# EAGLE design FSG_2019_BSPD_0.2_SMD (EAGLE 9.2.1)
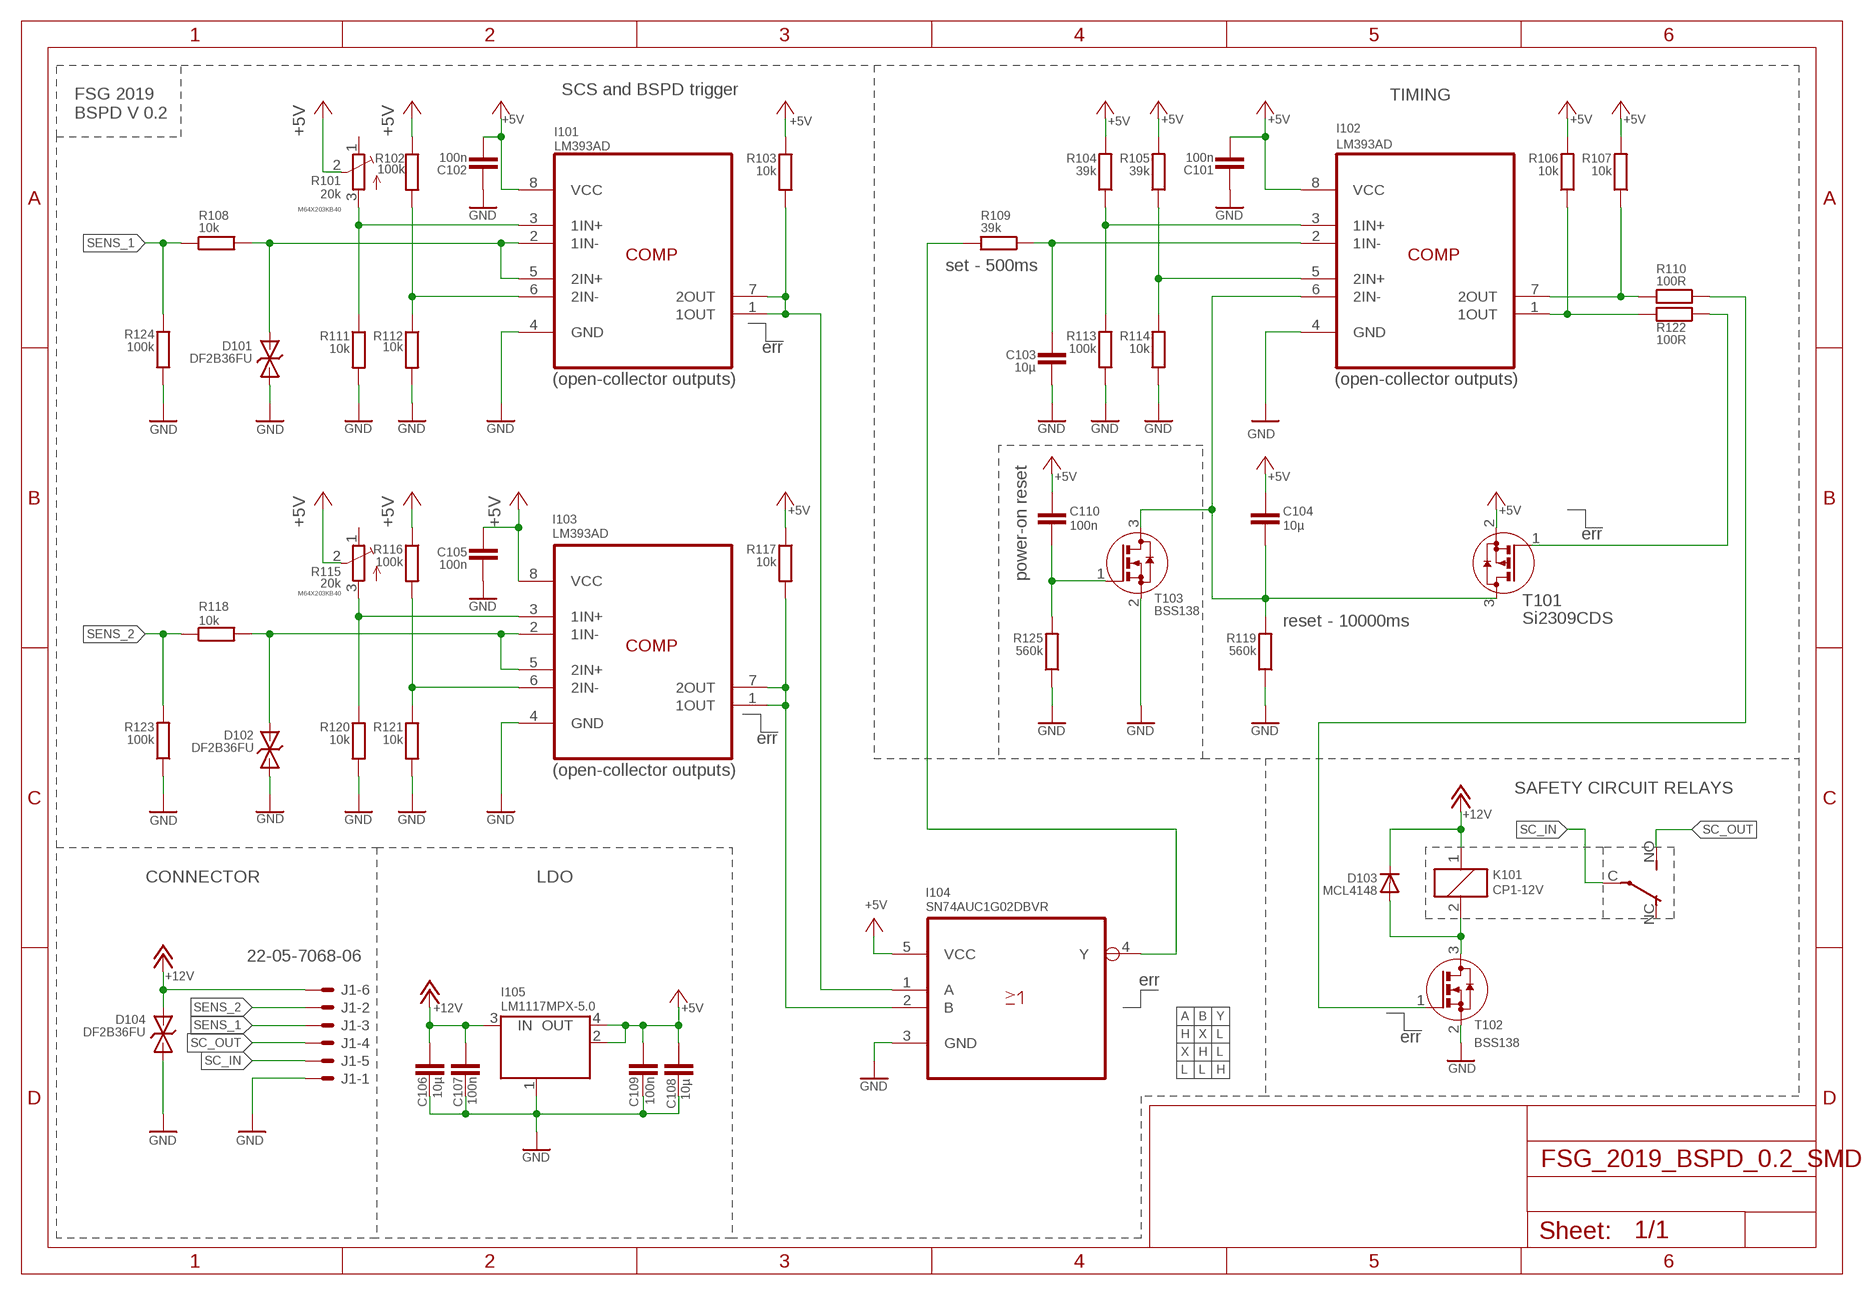
[diagram p0: schematic, sheet 1]

## Parts
C101  100n  C-EUC0603  [C0603]
C102  100n  C-EUC0603  [C0603]
C103  10µ  C-EUC1206  [C1206]
C104  10µ  C-EUC1206K  [C1206K]
C105  100n  C-EUC0603  [C0603]
C106  10µ  C-EUC1206  [C1206]
C107  100n  C-EUC0603  [C0603]
C108  10µ  C-EUC1206  [C1206]
C109  100n  C-EUC0603  [C0603]
C110  100n  C-EUC0603  [C0603]
D101  DF2B36FU  [SOD323]
D102  DF2B36FU  [SOD323]
D103  MCL4148  D.MCL4148  [MICROMELF]
D104  DF2B36FU  [SOD323]
I101  LM393AD  [SOIC127P600X175-8N]
I102  LM393AD  [SOIC127P600X175-8N]
I103  LM393AD  [SOIC127P600X175-8N]
I104  SN74AUC1G02DBVR  NC7SZ08M5X  [SOT95P280X145-5N]
I105  LM1117MPX-5.0  0022_LM1117IMPX-5.0  [LINEAR_SOT223]
J1  22-05-7068-06  [7395-06]
K101  CP1-12V  [CP1]
R101  20k  POTI.M64X201KB40  [M64X201KB40]
R102  100k  R-EU_R0603  [R0603]
R103  10k  R-EU_R0603  [R0603]
R104  39k  R-EU_R0603  [R0603]
R105  39k  R-EU_R0603  [R0603]
R106  10k  R-EU_R0603  [R0603]
R107  10k  R-EU_R0603  [R0603]
R108  10k  R-EU_R0603  [R0603]
R109  39k  R-EU_R0603  [R0603]
R110  100R  R-EU_R0603  [R0603]
R111  10k  R-EU_R0603  [R0603]
R112  10k  R-EU_R0603  [R0603]
R113  100k  R-EU_R0603  [R0603]
R114  10k  R-EU_R0603  [R0603]
R115  20k  POTI.M64X201KB40  [M64X201KB40]
R116  100k  R-EU_R0603  [R0603]
R117  10k  R-EU_R0603  [R0603]
R118  10k  R-EU_R0603  [R0603]
R119  560k  R-EU_R0603  [R0603]
R120  10k  R-EU_R0603  [R0603]
R121  10k  R-EU_R0603  [R0603]
R122  100R  R-EU_R0603  [R0603]
R123  100k  R-EU_R0603  [R0603]
R124  100k  R-EU_R0603  [R0603]
R125  560k  R-EU_R0603  [R0603]
T101  Si2309CDS  P-MOSFET.SOT23  [SOT-23]
T102  BSS138  N-MOSFET.SOT23  [SOT-23]
T103  BSS138  N-MOSFET.SOT23  [SOT-23]

## Nets
+5V: C101.2 C102.2 C104.1 C105.2 C108.1 C109.2 C110.1 I101.8(VCC) I102.8(VCC) I103.8(VCC) I104.5(VCC) I105.2(OUT) I105.4(OUT) R101.2(M) R102.1 R103.1 R104.2 R105.2 R106.2 R107.2 R115.2(M) R116.1 R117.1 T101.2(S)
+12V: C106.1 C107.1 D103.C D104.2(C) I105.3(IN) J1.6 K101.1
BRAKE_F: D101.2(C) I101.2(1IN-) I101.5(2IN+) R108.2
DF: D102.2(C) I103.2(1IN-) I103.5(2IN+) R118.2
GND: C101.1 C102.1 C103.2 C105.1 C106.2 C107.2 C108.2 C109.1 D101.1(A) D102.1(A) D104.1(A) I101.4(GND) I102.4(GND) I103.4(GND) I104.3(GND) I105.1(GND/ADJ) J1.1 R111.2 R112.2 R113.1 R114.1 R119.1 R120.2 R121.2 R123.1 R124.1 R125.1 T102.2(S) T103.2(S)
N$1: I102.5(2IN+) R105.1 R114.2
N$2: I103.1(1OUT) I103.7(2OUT) I104.2(B) R117.2
N$3: I101.1(1OUT) I101.7(2OUT) I104.1(A) R103.2
N$4: I102.1(1OUT) R106.1 R122.2
N$5: C110.2 R125.2 T103.1(G)
N$6: I101.3(1IN+) R101.3(A) R111.1
N$7: C104.2 I102.6(2IN-) R119.2 T101.3(D) T103.3(D)
N$8: I103.3(1IN+) R115.3(A) R120.1
N$10: R110.1 T102.1(G)
N$11: D103.A K101.2 T102.3(D)
N$12: C103.1 I102.2(1IN-) R109.1
N$13: I102.3(1IN+) R104.1 R113.2
N$14: I101.6(2IN-) R102.2 R112.1
N$15: I102.7(2OUT) R107.1 R110.2
N$16: I103.6(2IN-) R116.2 R121.1
N$20: R122.1 T101.1(G)
N$66: I104.4(Y) R109.2
SC_IN: J1.5 K101.C(2:P)
SC_OUT: J1.4 K101.NO(2:S)
SENS_1: J1.3 R108.1 R124.2
SENS_2: J1.2 R118.1 R123.2
Unconnected: K101.NC(2:O) R101.1(E) R115.1(E)

## Notes on the sheet
- SCS and BSPD trigger
- TIMING
- FSG 2019
  BSPD V 0.2
- M64X203KB40
- COMP | COMP
- set - 500ms
- err
- (open-collector outputs) | (open-collector outputs)
- err
- power-on reset
- M64X203KB40
- reset - 10000ms
- COMP
- err
- (open-collector outputs)
- SAFETY CIRCUIT RELAYS
- CONNECTOR | LDO
- err
- A | B | Y
- H | X | L
- err
- X | H | L
- L | L | H

## Library data of the parts
C101 C102 C105 = resistor:C-EU: CAPACITOR, European symbol
C103 C104 C106-C110 = rcl:C-EU: CAPACITOR, European symbol
D101 D102 D104 = diode:DF2B36FU
D103 = MCS-Dioden:D; HEIGHT: 1.2
I101-I103 = TI-LM393AD:LM393AD: DUAL DIFFERENTIAL COMPARATORS,SOIC-8; MPN: LM393AD; OC_FARNELL: 4586128; OC_NEWARK: 91F3640; PACKAGE: SOIC- 8; SUPPLIER: TEXAS INSTRUMENTS
I104 = Arduino:NC7SZ08M5X: Tiny logic UHS Two Input AND Gate; MPN: NC7SZ08M5X; OC_FARNELL: 1613980; OC_NEWARK: 58K1975; PACKAGE: SOT-23-5; SUPPLIER: Fairchild
I105 = IntegratedCircuits:0022_LM1117IMPX-5.0: Low-dropout linear regulator 5V -LM1117IMPX-5.0; CASE: SOT223; MONTHLY_USAGE: _____; PART_NUMBER: LM1117IMPX-5.0; PRICE: _____; SUPPLIER: _____; TYPE: Circuito_Integrato; VALUE: LM1117IMPX-5.0
J1 = con-molex:22-?-06: CONNECTOR wire to board 2.54 mm (.1 inch) pitch header; MF: MOLEX; OC_FARNELL: unknown; OC_NEWARK: unknown
K101 = relay:CP1?-*: ULTRA-MINIATURE LOW PROFILE AUTOMOTIVE RELAY NAiS Source: http://www.mew-europe.com/.. en_ds_61207_0000.pdf; MF: AROMAT/ MATSUSHITA; MPN: CP1-12V; OC_FARNELL: unknown; OC_NEWARK: 10C5508
R101 R115 = MCS-rcl:POTI
R102-R114 R116-R125 = resistor:R-EU_: RESISTOR, European symbol
T101 = MCS-Transistoren:P-MOSFET; HEIGHT: 1.2
T102 T103 = MCS-Transistoren:N-MOSFET; HEIGHT: 1.2

## Board
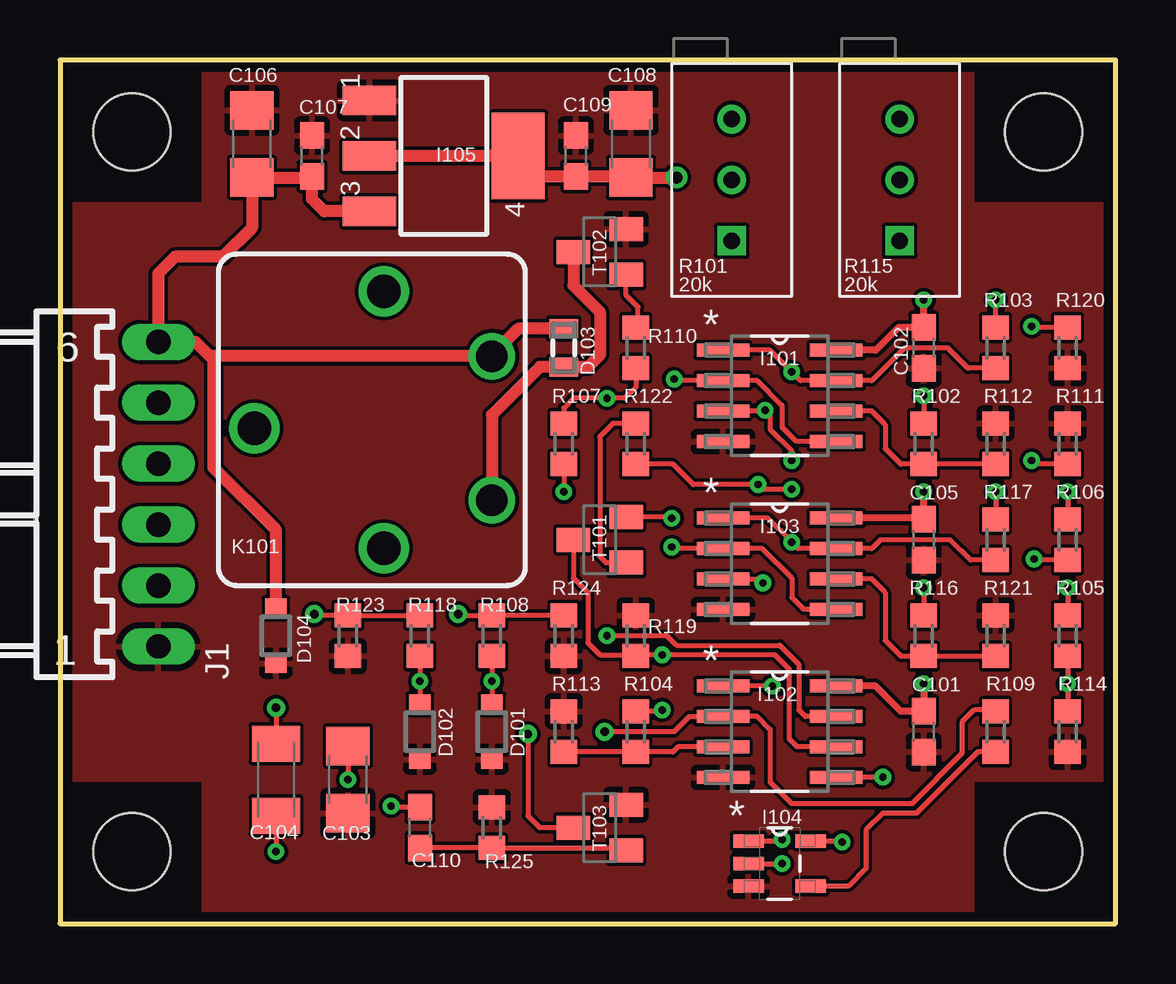
[diagram p1: board, top side]
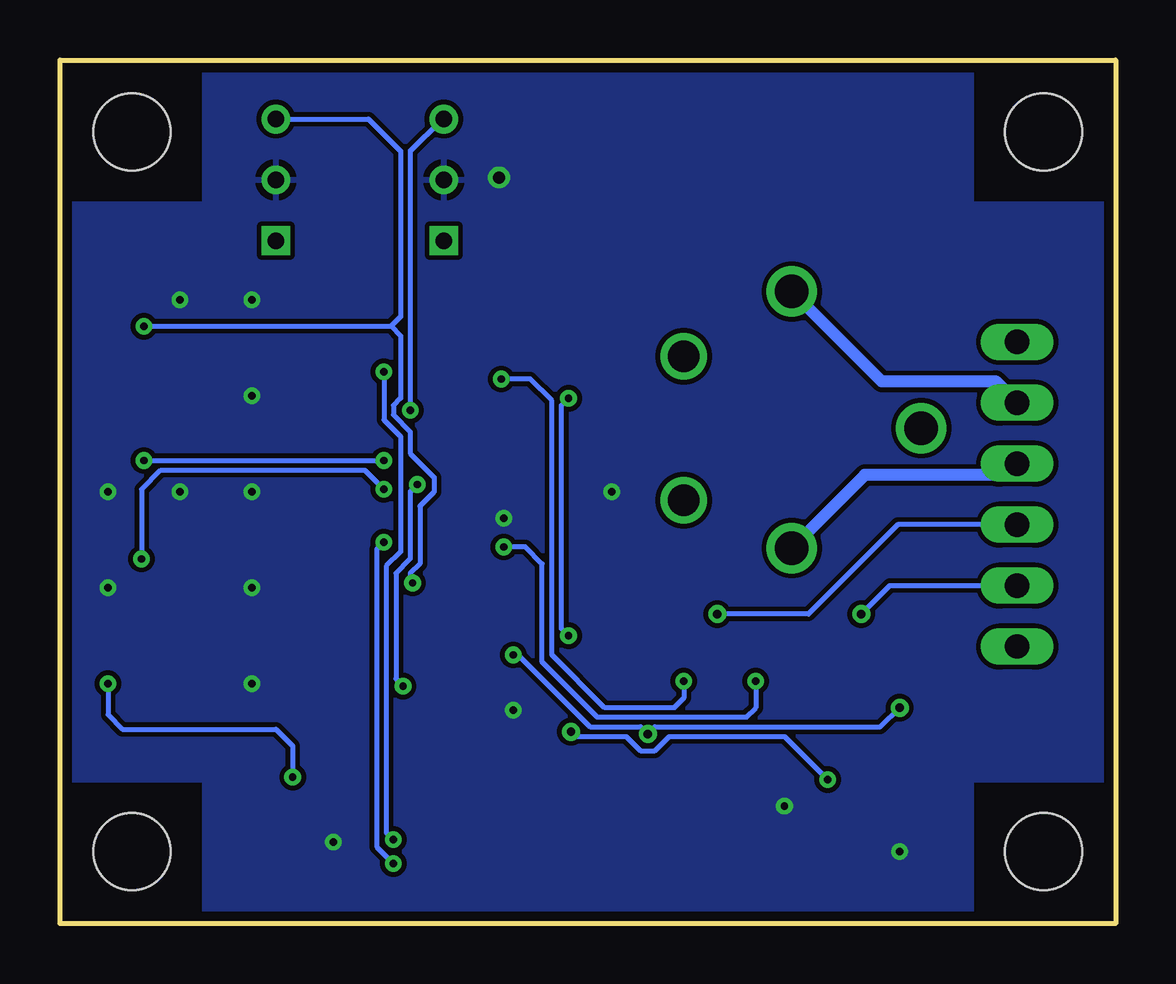
[diagram p2: board, bottom side, seen from below]

Size 44 x 36 mm. Coordinates in mm from the lower left corner, seen from the top.
Outline: 0,0 44,0 44,36 0,36 0,0
Copper layers (1*16): Top 0.035mm / dielectric 0.11mm / Bottom 0.035mm
Design rules "MCS-standard *": minimum track width 0.15mm, minimum drill 0.3mm, track to track 0.15mm, track to pad 0.15mm, pad to pad 0.15mm, via to via 0.15mm, smd to smd 0.15mm, copper to edge 0.4mm, drill to drill 0.3mm, minimum pad ring 10mil, minimum via ring 0.2mm, stop-mask expansion 0.05mm, vias tented up to drill 0.4mm, thermal gap 10mil
Holes 3.2 mm at 3,33 3,3 41,3 41,33
tKeepout: area 38.2,30.2 to 43.8,35.8; area 0.2,30.2 to 5.8,35.8; area 0.2,0.2 to 5.8,5.8; area 38.2,0.2 to 43.8,5.8

### Footprints (pad centres in the part's own frame; a part is rotated, then mirrored left to right if it is on the bottom)
C0603 = smd 1.1 x 1: 1 -0.85,0; 2 0.85,0
C1206 = smd 1.6 x 1.8: 1 -1.4,0; 2 1.4,0
C1206K = smd 1.5 x 2: 1 -1.5,0; 2 1.5,0
SOD323 = smd 0.8 x 0.9: 1 -1.15,0; 2 1.15,0
MICROMELF = smd 0.8 x 1.2: A -0.8,0; C 0.8,0
SOIC127P600X175-8N = smd 2.184 x 0.559: 1 -2.362,1.905; 2 -2.362,0.635; 3 -2.362,-0.635; 4 -2.362,-1.905; 5 2.362,-1.905; 6 2.362,-0.635; 7 2.362,0.635; 8 2.362,1.905
SOT95P280X145-5N = smd 1.27 x 0.559: 1 -1.295,0.94; 2 -1.295,0; 3 -1.295,-0.94; 4 1.295,-0.94; 5 1.295,0.94
LINEAR_SOT223 = smd 1.219 x 2.235: 1 -2.311,-3.099; 2 0,-3.099; 3 2.311,-3.099 | smd 3.6 x 2.2: 4 0,3.099
7395-06 = drill 1.016 long: 1 6.35,0; 2 3.81,0; 3 1.27,0; 4 -1.27,0; 5 -3.81,0; 6 -6.35,0
CP1 = drill 1.3: 1 2.65,-4.5; 2 -3.35,-4.5 | drill 1.4: C 5.35,0; NC -0.35,5.4; NO -5.35,0
M64X201KB40 = drill 0.7 square: 1 -2.54,0 | drill 0.7: 2 0,0; 3 2.54,0
R0603 = smd 1 x 1.1: 1 -0.85,0; 2 0.85,0
SOT-23 = smd 1 x 1.4: 1 -0.95,-1.1; 2 0.95,-1.1; 3 0,1.1

### Placement (x,y rotation side)
C101  36,8 90 top
C102  36,24 90 top
C103  12,6 270 top
C104  9,6 90 top
C105  36,16 90 top
C106  8,32.5 90 top
C107  10.5,32 90 top
C108  23.8,32.5 90 top
C109  21.5,32 270 top
C110  15,4 270 top
D101  18,8 90 top
D102  15,8 90 top
D103  21,24 90 top
D104  9,12 90 top
I101  30,22 0 top
I102  30,8 0 top
I103  30,15 0 top
I104  30,2.5 0 top
I105  16,32 270 top
J1  4.1,17.9 270 top
K101  13.5,21 90 top
R101  28,31 90 top
R102  36,20 270 top
R103  39,24 270 top
R104  24,8 90 top
R105  42,12 90 top
R106  42,16 90 top
R107  21,20 270 top
R108  18,12 270 top
R109  39,8 270 top
R110  24,24 270 top
R111  42,20 90 top
R112  39,20 90 top
R113  21,8 270 top
R114  42,8 90 top
R115  35,31 90 top
R116  36,12 270 top
R117  39,16 270 top
R118  15,12 270 top
R119  24,12 270 top
R120  42,24 270 top
R121  39,12 90 top
R122  24,20 270 top
R123  12,12 90 top
R124  21,12 90 top
R125  18,4 270 top
T101  22.5,16 90 top
T102  22.5,28 90 top
T103  22.5,4 90 top

### Tracks (layer width: path | path; a pad name or v marks a point on that pad's centre or on a via)
+5V  (via drill 0.3, 0.5)
  Top 0.2: v36,14 R116.1 | v36,22 R102.1 | R107.2 v21,18 | T101.2 25.45,16.95 v25.5,16.9 | R104.2 25.05,8.85 v25.1,8.9 | v42,14 R105.2 | v42,18 R106.2 | C110.1 13.85,4.85 v13.8,4.9 | C104.1 v9,3 | I104.5 32.56,3.44 v32.6,3.4 | v39,18 R117.1 | R103.1 v39,26
  Top 0.3: I101.8 34.01,23.91 34.95,24.85 C102.2 v36,26 | I103.8 35.95,16.91 C105.2 v36,18 | I102.8 33.99,9.9 35.05,8.85 C101.2 v36,10
  Top 0.5: I105.2 I105.4 19.95,31.15 C109.2 23.75,31.15 C108.1 v25.7,31.1
  pour Bottom (isolate 0.2): 6,36 38,36 38,30 44,30 44,6 38,6 38,0 6,0 6,6 0,6 0,30 6,30
+12V
  Top 0.5: K101.1 18,23.7 19.1,24.8 D103.C | I105.3 11.01,29.69 10.5,30.2 C107.1 10.45,31.1 C106.1 8,29 6.8,27.8 4.8,27.8 4.1,27.1 | D104.2 9,16.4 6.4,19
  Top 0.508: 4.1,27.1 J1.6 5.65,24.25 6.15,23.75 6.25,23.65 | 6.4,19 6.4,23.5 6.25,23.65 | K101.1 6.25,23.65
BRAKE_F  (via drill 0.3)
  Top 0.2: v25.6,22.7 25.66,22.64 I101.2 29.07,22.64 30.1,21.6 30.1,20.7 30.7,20.1 I101.5 | D101.2 v18,10.1 R108.2
  Bottom 0.2: v25.6,22.7 24.4,22.7 23.5,21.8 23.5,11.2 21.3,9 18.4,9 18,9.4 v18,10.1
DF  (via drill 0.3)
  Top 0.2: v25.5,15.7 25.57,15.63 I103.2 29.27,15.63 30.5,14.4 30.5,13.6 31,13.1 I103.5 | R118.2 v15,10.1 D102.2
  Bottom 0.2: v15,10.1 15,9 15.4,8.6 21.6,8.6 23.9,10.9 23.9,15 24.6,15.7 v25.5,15.7
GND
  pour Top: 0,30 6,30 6,36 38,36 38,30 44,30 44,6 38,6 38,0 6,0 6,6 0,6
N$1  (via drill 0.3)
  Top 0.2: R114.2 v42,10 R105.1 | I102.5 v34.3,6.09 v34.3,6.1
  Bottom 0.2: v42,10 42,8.7 41.4,8.1 35,8.1 34.3,7.4 v34.3,6.1
N$2  (via drill 0.3)
  Top 0.2: I103.1 29.5,16.91 v30.5,15.9 30.77,15.63 I103.7 33.84,15.63 34.2,16 37.1,16 37.95,15.15 R117.2 | I104.2 v30.1,2.5
  Bottom 0.2: v30.5,15.9 30.8,15.6 30.8,3.2 v30.1,2.5
N$3  (via drill 0.3)
  Top 0.2: I101.1 29.59,23.91 v30.5,23 30.86,22.64 I101.7 33.84,22.64 35.2,24 37,24 37.85,23.15 R103.2 | I104.1 30.04,3.44 v30.1,3.5
  Bottom 0.2: v30.5,23 30.5,21 29.8,20.3 29.8,15.5 30.4,14.9 30.4,3.8 v30.1,3.5
N$4  (via drill 0.3)
  Top 0.2: R122.2 25.55,19.15 26.4,18.3 v29.1,18.3 29.3,18.1 v30.5,18.1 | v29.7,9.9 I102.1 | R106.1 40.65,15.15 v40.6,15.2
  Bottom 0.2: v29.1,18.3 29.4,18 29.4,15.2 30,14.6 30,10.2 v29.7,9.9 | v40.6,15.2 40.6,18.1 39.8,18.9 31.3,18.9 v30.5,18.1
N$5
  Top 0.2: C110.2 R125.2 23.5,3.15 T103.1
N$6  (via drill 0.3)
  Top 0.2: I101.3 29.36,21.36 v29.4,21.4 29.6,21.2 29.6,20.6 30.5,19.7 v30.5,19.3 | R111.1 40.65,19.15 v40.5,19.3
  Bottom 0.2: v29.4,21.4 29.4,32.2 28.06,33.54 R101.3 | v40.5,19.3 v30.5,19.3
N$7  (via drill 0.3, 0.35)
  Top 0.2: v9,9 C104.2 | T101.3 21.4,14.4 22,13.8 22,11.7 22.5,11.2 24.05,11.2 | T103.3 20,4 19.5,4.5 v19.5,7.9 | I102.6 30.73,7.37 30.4,7.7 30.4,10.6 29.8,11.2 v25.1,11.2 24.05,11.2 | 24.05,11.2 R119.2
  Bottom 0.2: v9,9 9.8,8.2 19.2,8.2 v19.5,7.9 19.8,8.2 21.9,8.2 24.9,11.2 v25.1,11.2
N$8  (via drill 0.3)
  Top 0.2: v29.3,14.2 29.14,14.37 I103.3 | R120.1 40.55,24.85 v40.5,24.9
  Bottom 0.2: R115.3 31.14,33.54 29.8,32.2 29.8,25.3 30.2,24.9 | 30.2,24.9 29.8,24.5 29.8,21.9 30.1,21.6 30.1,21.2 29.4,20.5 29.4,19.6 28.4,18.6 28.4,18 29,17.4 29,15 29.4,14.6 29.4,14.3 v29.3,14.2 | v40.5,24.9 30.2,24.9
N$10
  Top 0.2: R110.1 24.1,24.95 24.1,25.7 23.6,26.2 T102.1
N$11
  Top 0.5: T102.3 21.4,26.6 22.5,25.5 22.5,23.7 22,23.2 D103.A 20,23.2 18,21.2 K101.2
N$12  (via drill 0.3, 0.35)
  Top 0.2: R109.1 38.95,8.9 38.1,8.9 37.6,8.4 37.6,7.1 35.5,5 30.5,5 29.6,5.9 29.6,8.1 29.07,8.63 I102.2 26.23,8.63 25.6,8 v22.7,8 | C103.1 v12,6
  Bottom 0.2: v12,6 13.8,7.8 18.6,7.8 19.2,7.2 19.8,7.2 20.4,7.8 22.5,7.8 v22.7,8
N$13
  Top 0.2: I102.3 25.77,7.37 25.55,7.15 R104.1 R113.2
N$14
  Top 0.2: R112.1 R102.2 35.05,19.15 34.4,19.8 34.4,20.8 33.84,21.36 I101.6
N$15  (via drill 0.3)
  Top 0.2: R107.1 21,21.5 21.4,21.9 v22.8,21.9 23.55,21.9 24,22.35 R110.2 | I102.7 31.07,8.63 30.8,8.9 30.8,10.8 30,11.6 25.7,11.6 25.3,12 v22.8,12
  Bottom 0.2: v22.8,12 23.1,12.3 23.1,21.6 v22.8,21.9
N$16
  Top 0.2: I103.6 33.84,14.37 34.4,13.8 34.4,11.8 35.05,11.15 R116.2 R121.1
N$20
  Top 0.2: R122.1 23.05,20.85 22.5,20.3 22.5,15.3 22.75,15.05 T101.1
N$66
  Top 0.2: R109.2 38.25,7.15 35.7,4.6 34.3,4.6 33.6,3.9 33.6,2.3 32.86,1.56 I104.4
SC_IN
  Bottom 0.5: K101.C 9.75,22.6 4.99,22.6
  Bottom 0.508: J1.5 4.99,22.6
SC_OUT
  Bottom 0.5: K101.NO 10.45,18.7 4.57,18.7
  Bottom 0.508: J1.4 4.57,18.7
SENS_1  (via drill 0.35)
  Top 0.2: R124.2 R108.1 16.65,12.85 v16.6,12.9
  Bottom 0.2: v16.6,12.9 12.8,12.9 9.07,16.63 J1.3
SENS_2  (via drill 0.35)
  Top 0.2: R118.1 R123.2 10.65,12.85 v10.6,12.9
  Bottom 0.2: v10.6,12.9 9.41,14.09 J1.2

### Text on the board
tStop: S1 | S2 | FSG 2019 BSPD V0.2